# EasyEDA Pro project ProPrj_IoT Animal Trap_2026-03-28 1.epro, board PCB1
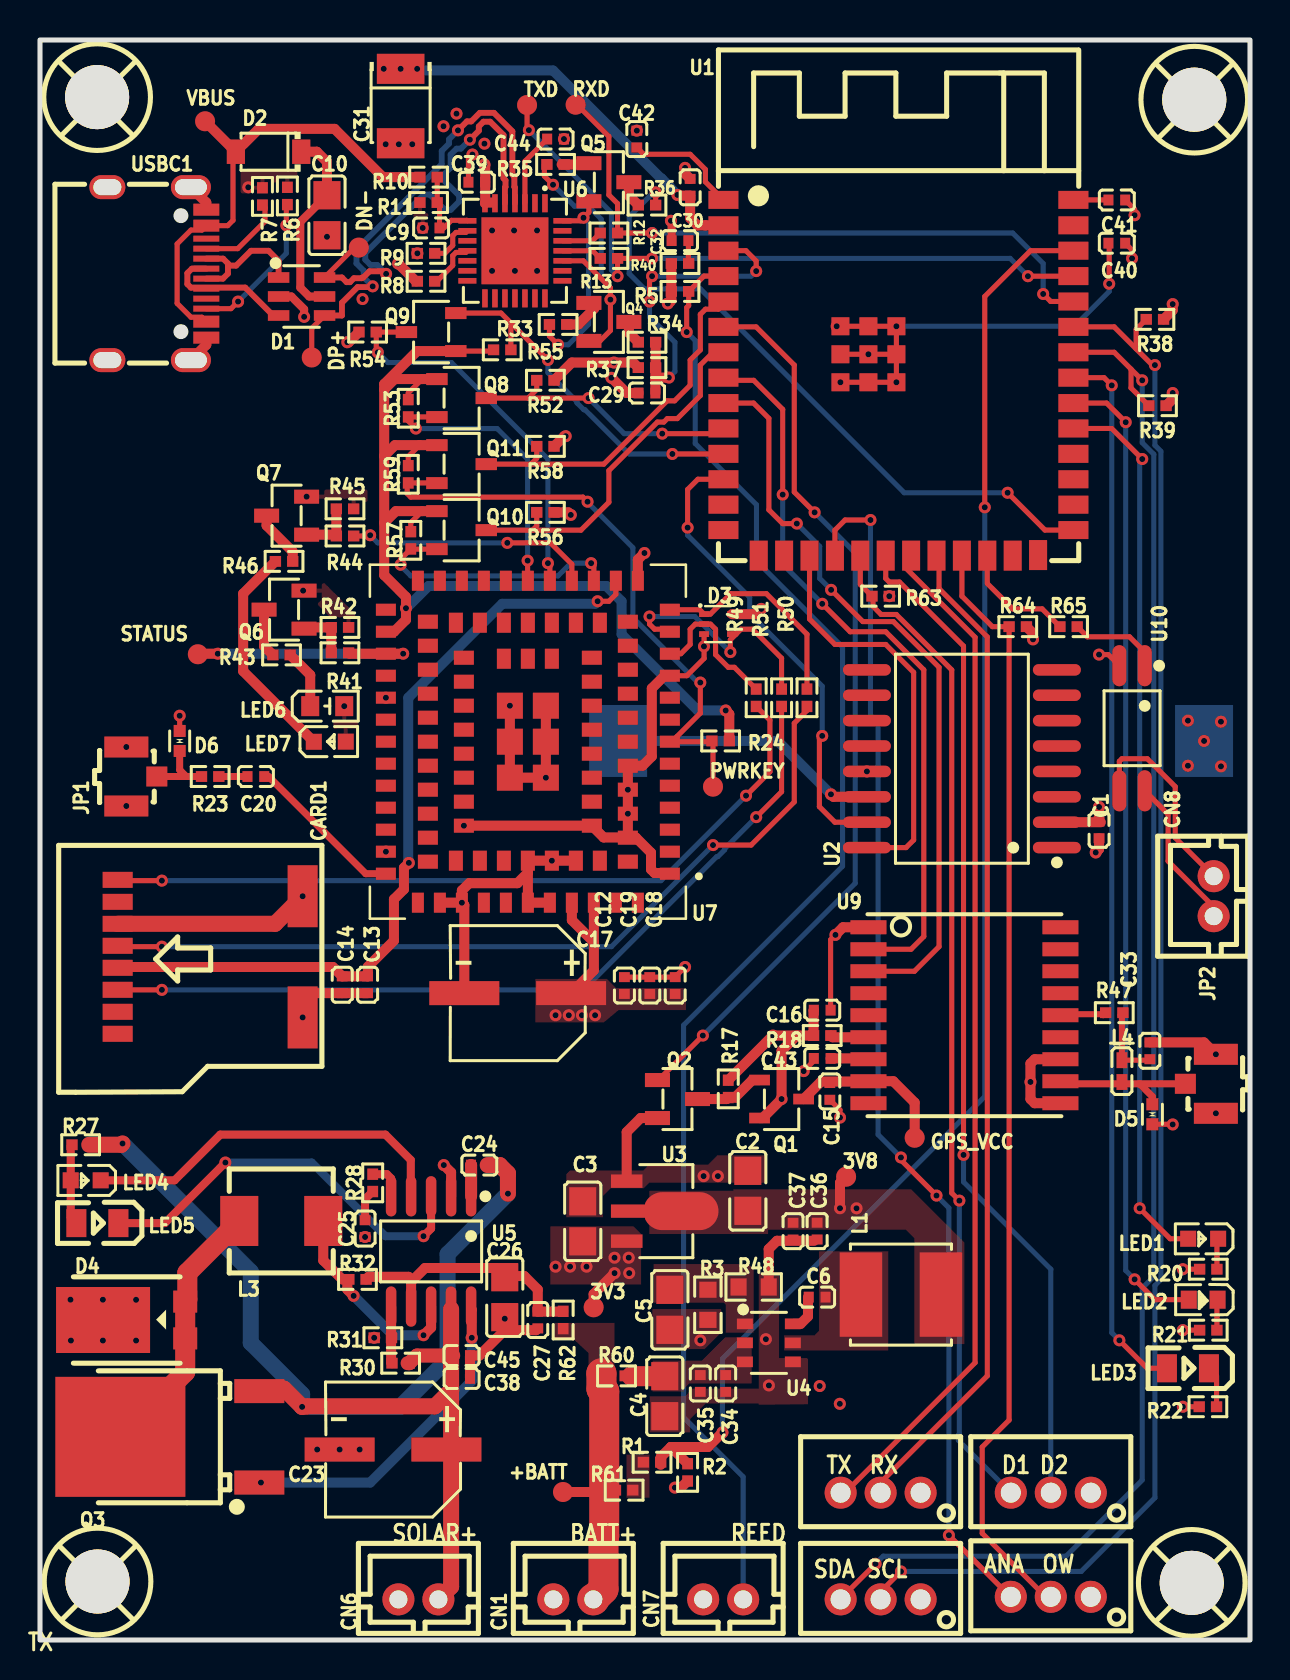
[diagram p1: board, top side]
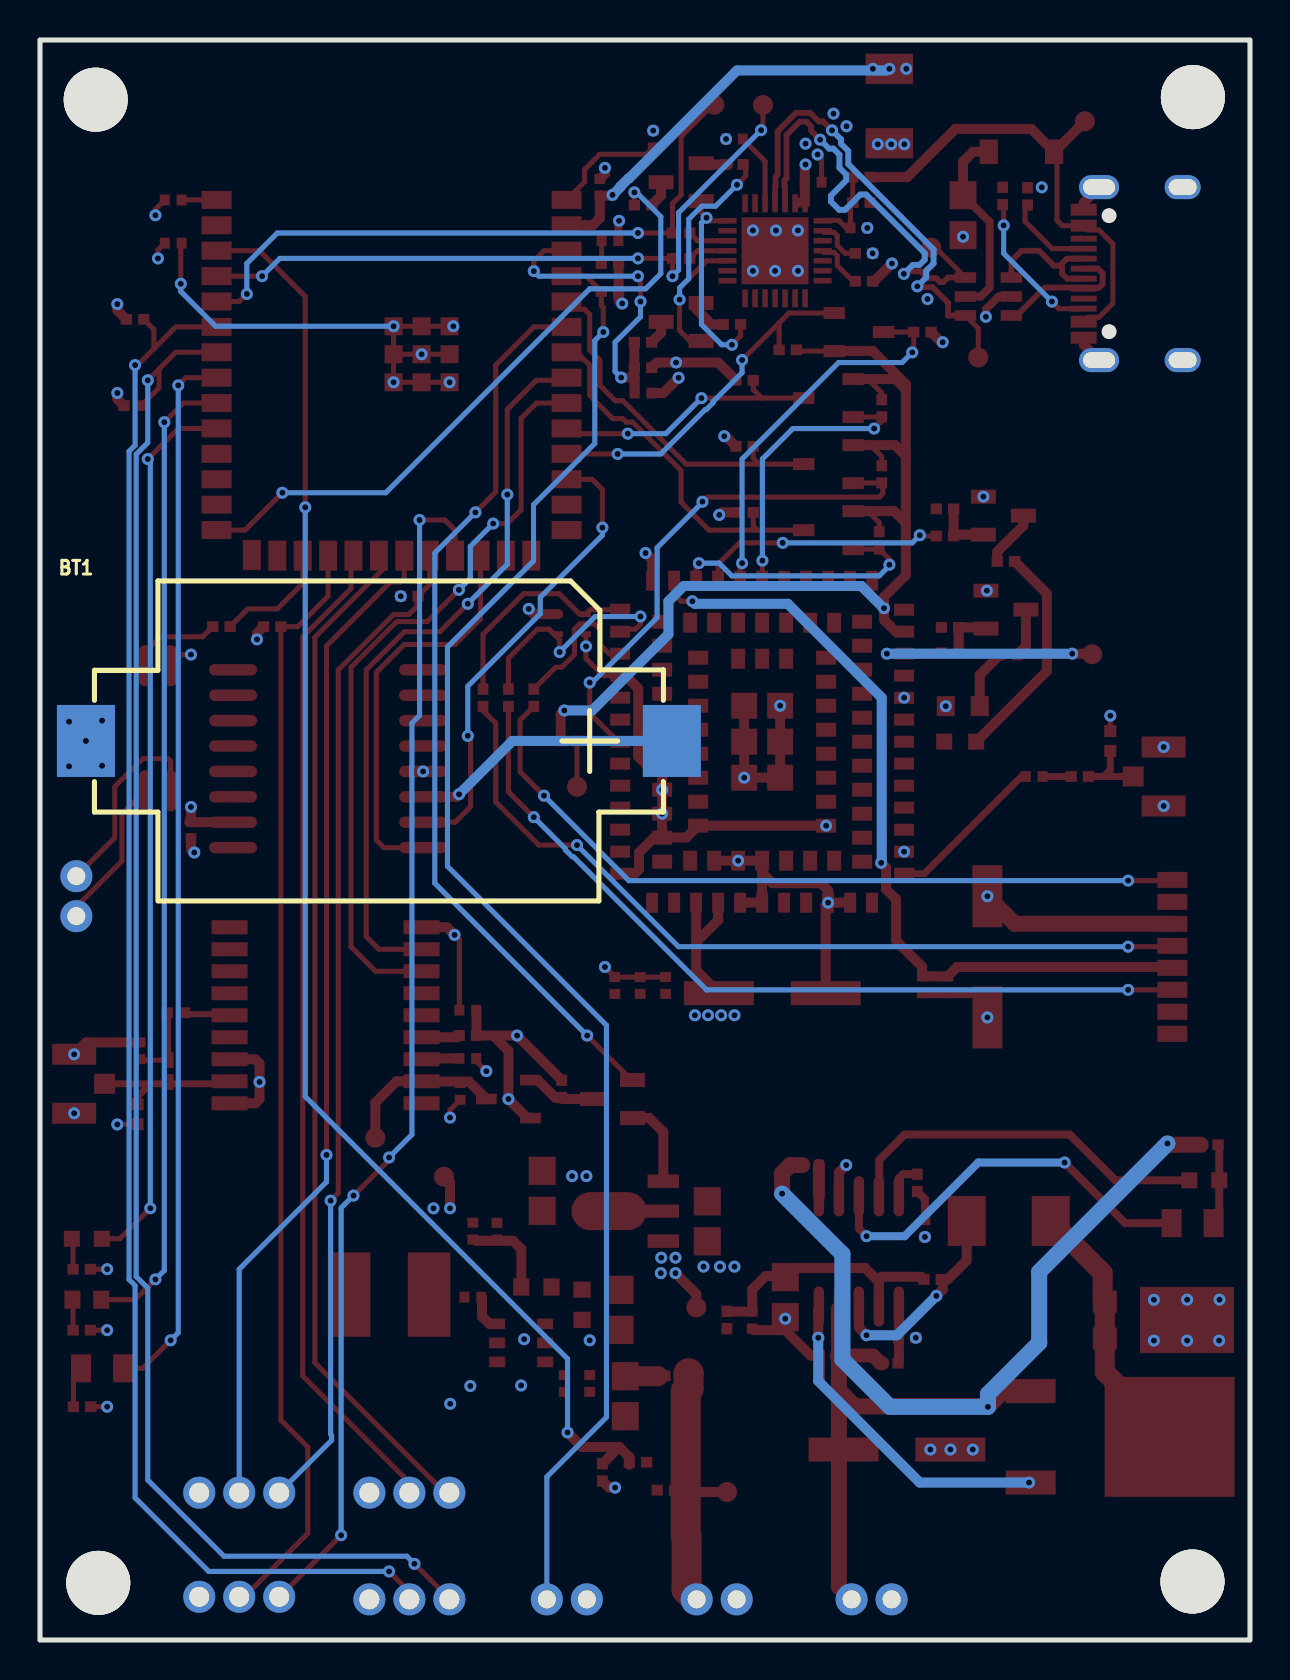
[diagram p2: board, bottom side, seen from below]

Outline 60.51 x 80.01 mm; copper layers: Top Layer, Ground Ref, Power Plane, Inner3, Inner4, Inner5, Inner6, Inner7, Inner8, Inner9, Inner10, Inner11, Inner12, Inner13, Inner14, Inner15, Inner16, Inner17, Inner18, Inner19, Inner20, Inner21, Inner22, Inner23, Inner24, Inner25, Inner26, Inner27, Inner28, Inner29, Inner30, Bottom Layer. Coordinates in mm from the lower left corner of the outline.
Outline path: rectangle 0,80.01 60.51,0
Stack: Top Layer 0.035mm Outer layer thickness 1oz / Dielectric1 0.2104mm 7628 RC49% 8.6mil / Ground Ref 0.0152mm Inner layer thickness / Dielectric2 1.065mm 1.1mm H/HOZ Copper / Power Plane 0.0152mm Inner layer thickness / Dielectric3 0.2104mm 7628 RC49% 8.6mil / Bottom Layer 0.035mm Outer layer thickness 1oz

## Design rules (mm)
net $1N3598: DP1
net $1N3569: DP1
net DP+: DP2
net DN-: DP2
template: Custom Config
spacing copperThickness1oz (default): track to track 0.102, other pairs 0.152 to 0.3
spacing copperThickness2oz: track to track 0.203, other pairs 0.152 to 0.3
track width copperThickness1oz (default): min 0.2, default 0.254, max 2.54
track width copperThickness2oz: min 0.203, default 0.254, max 2.54
track width 3V3: min 0.5, default 0.5, max 2.54
differential pair differentialPair (default): width min 0.127, default 0.254, max 2.54; gap min 0.152, default 0.152
via viaSize (default): diameter min 0.5, default 0.6, max 10; hole min 0.3, default 0.305, max 6.3
net 3V3 uses 3V3

## Placement (name value [footprint] x y rotation side)
3V3  -  [Test-Point-0.5mm]  27.69 16.64 0 top
3V8  -  [Test-Point-0.5mm]  40.31 23.17 0 top
+BATT  -  [Test-Point-0.5mm]  26.15 7.4 90 top
BT1  CR2032-B1  [BAT-SMD_CR2032-B1]  43.56 44.96 180 bottom
C1  100nF  [C0402]  52.96 40.51 90 top
C2  10uF  [C0805]  35.39 22.46 270 top
C3  10uF  [C0805]  27.14 20.94 270 top
C4  10uF  [C0805]  31.24 12.19 90 top
C5  47uF  [C0805]  31.5 16.51 270 top
C6  100nF  [C0402]  38.86 17.15 180 top
C9  100nF  [C0402]  19.56 70.61 0 top
C10  10uF  [C0805]  14.35 71.25 90 top
C12  100nF  [C0402]  29.22 32.73 270 top
C13  100nF  [C0402]  16.38 32.77 90 top
C14  22pF  [C0402]  15.11 32.77 90 top
C15  100nF  [C0402]  39.5 27.43 90 top
C16  100nF  [C0402]  39.12 31.5 180 top
C17  100uF  [CAP-SMD_BD6.3-L6.6-W6.6-LS7.2-FD]  23.89 32.35 180 top
C18  10pF  [C0402]  31.76 32.73 270 top
C19  33pF  [C0402]  30.49 32.73 270 top
C20  100pF  [C0402]  10.79 43.18 180 top
C23  47uF  [CAP-SMD_BD6.3-L6.6-W6.6-FD]  17.65 9.53 180 top
C24  100nF  [C0402]  21.97 23.75 0 top
C25  220nF  [C0402]  16.26 20.57 90 top
C26  47uF  [C0805]  23.24 17.15 90 top
C27  1uF  [C0402]  24.89 16 90 top
C29  100nF  [C0402]  30.35 62.36 0 top
C30  100nF  [C0402]  32.51 72.64 270 top
C31  10uF  [CASE-B_3528]  18.03 76.71 270 top
C32  100nF  [C0402]  32 69.98 0 top
C33  10nF  [C0402]  55.5 29.46 270 top
C34  100nF  [C0402]  34.29 12.83 90 top
C35  1uF  [C0402]  33.02 12.83 90 top
C36  22uF  [C0402]  38.86 20.45 90 top
C37  22uF  [C0402]  37.66 20.44 90 top
C38  1uF  [C0402]  21.08 13.08 180 top
C39  100nF  [C0402]  21.84 72.9 0 top
C40  100nF  [C0402]  53.85 69.85 180 top
C41  100nF  [C0402]  53.85 72.01 180 top
C42  100nF  [C0402]  29.84 75.06 90 top
C43  100nF  [C0402]  39.12 29.08 0 top
C44  100nF  [C0402]  25.78 75.06 180 top
C45  100nF  [C0402]  21.08 14.22 180 top
CARD1  TF-104  [TF-SMD_TF-104]  8.51 34.16 270 top
CN1  B2B-PH-K-S(LF)(SN)  [CONN-TH_B2B-PH-K-S]  26.67 2.03 0 top
CN2  B3B-PH-K-S(LF)(SN)  [CONN-TH_B3B-PH-K-S]  42.04 2.03 0 top
CN3  B3B-PH-K-S(LF)(SN)  [CONN-TH_B3B-PH-K-S]  50.55 7.37 0 top
CN4  B3B-PH-K-S(LF)(SN)  [CONN-TH_B3B-PH-K-S]  50.55 2.16 0 top
CN5  B3B-PH-K-S(LF)(SN)  [CONN-TH_B3B-PH-K-S]  42.04 7.37 0 top
CN6  B2B-PH-K-S(LF)(SN)  [CONN-TH_B2B-PH-K-S]  18.92 2.03 0 top
CN7  B2B-PH-K-S(LF)(SN)  [CONN-TH_B2B-PH-K-S]  34.16 2.03 0 top
CN8  B2B-PH-K-S(LF)(SN)  [CONN-TH_B2B-PH-K-S]  58.69 37.19 90 top
D1  USBLC6-2SC6  [SOT-23-6_L2.9-W1.6-P0.95-LS2.8-BL]  13.08 67.18 270 top
D2  1N5819HW-7-F  [SOD-123_L2.7-W1.6-LS3.7-RD]  11.43 74.42 180 top
D3  TPD3E001DRLR  [SOT-553-5_L1.6-W1.2-P0.50-LS1.6-TL]  33.91 50.8 0 top
D4  SB1045L  [TO-277_3P-L5.4-W4.0-LS6.5-TR]  5.21 16 0 top
D5  ESD701DPYR  [X1SON-2_L1.0-W0.6-P0.65-BI]  55.63 26.29 90 top
D6  ESD701DPYR  [X1SON-2_L1.0-W0.6-P0.65-BI]  6.98 44.96 270 top
DN-  -  [Test-Point-0.5mm]  15.94 69.63 0 top
DP+  -  [Test-Point-0.5mm]  13.59 64.14 0 top
GPS_VCC  -  [Test-Point-0.5mm]  43.74 25.12 0 top
JP1  6GHz  [RF-SMD_FRF05002-JSS103M]  5.08 43.18 90 top
JP2  6GHz  [RF-SMD_FRF05002-JSS103M]  58.04 27.81 270 top
L1  4.7uH  [IND-SMD_L5.0-W5.0]  43.05 17.27 180 top
L3  10uH  [IND-SMD_L5.2-W5.2_MCW-0530]  12.06 20.96 0 top
L4  27nH  [L0402-RD]  54.1 28.45 270 top
LED1  19-217/GHC-YR1S2/3T  [LED0603-RD]  58.17 20.07 180 top
LED2  19-217/BHC-ZL1M2RY/3T  [LED0603-FD_BLUE]  58.17 17.02 180 top
LED3  17-21SURC/S530-A3/TR8  [LED0805-R-RD]  57.4 13.59 180 top
LED4  19-217/GHC-YR1S2/3T  [LED0603-RD]  2.29 22.99 180 top
LED5  17-21SURC/S530-A3/TR8  [LED0805-R-RD]  2.87 20.85 180 top
LED6  SML-D12P8WT86C  [LED0603-FD_GREEN]  14.36 46.7 180 top
LED7  YLED0603Y  [LED0603-RD-1]  14.49 44.92 0 top
M1  -  [Screw-Hole-M3]  2.94 2.86 0 top
M2  -  [Screw-Hole-M3]  57.66 2.79 0 top
M3  -  [Screw-Hole-M3]  57.78 76.96 0 top
M4  -  [Screw-Hole-M3]  2.92 77.09 0 top
PWRKEY  -  [Test-Point-0.5mm]  33.66 42.67 0 top
Q1  SI2301CDS-T1-GE3  [SOT-23-3_L3.0-W1.7-P0.95-LS2.9-BR]  37.08 27.05 180 top
Q2  BSS138  [SOT-23-3_L2.9-W1.3-P1.90-LS2.4-BR_1]  31.88 27.05 180 top
Q3  AOD4185  [TO-252-3_L6.6-W6.1-P4.57-LS9.9-BR-CW]  7.49 10.16 0 top
Q4  L8050QLT1G  [SOT-23-3_L2.9-W1.3-P1.90-LS2.4-BR]  28.45 65.91 180 top
Q5  L8050QLT1G  [SOT-23-3_L2.9-W1.3-P1.90-LS2.4-BR]  28.45 72.9 180 top
Q6  S8050  [SOT-23-3_L2.9-W1.3-P1.90-LS2.4-BR]  12.21 51.52 0 top
Q7  S8050  [SOT-23-3_L2.9-W1.3-P1.90-LS2.4-BR]  12.33 56.22 0 top
Q8  BSS138  [SOT-23-3_L2.9-W1.6-P1.90-LS2.8-BR]  21.08 62.1 180 top
Q9  BSS138  [SOT-23-3_L2.9-W1.6-P1.90-LS2.8-BR]  19.56 65.41 0 top
Q10  BSS138  [SOT-23-3_L2.9-W1.6-P1.90-LS2.8-BR]  21.08 55.5 180 top
Q11  BSS138  [SOT-23-3_L2.9-W1.6-P1.90-LS2.8-BR]  21.08 58.8 180 top
R1  1MΩ  [R0402]  30.61 8.89 0 top
R2  470kΩ  [R0402]  32.38 8.38 90 top
R3  100kΩ  [R0603]  33.4 16.76 270 top
R5  100kΩ  [R0402]  32 67.44 180 top
R6  5.1kΩ  [R0402]  12.37 72.21 90 top
R7  5.1kΩ  [R0402]  11.12 72.19 90 top
R8  10kΩ  [R0402]  19.3 67.94 0 top
R9  1kΩ  [R0402]  19.3 69.34 0 top
R10  22.1kΩ  [R0402]  19.43 73.15 0 top
R11  47.5kΩ  [R0402]  19.43 71.88 0 top
R12  0Ω  [R0402]  28.45 70.36 0 top
R13  0Ω  [R0402]  28.45 69.09 0 top
R17  10kΩ  [R0402]  34.42 27.56 90 top
R18  100Ω  [R0402]  39.12 30.23 0 top
R20  22Ω  [R0402]  58.42 18.54 180 top
R21  22Ω  [R0402]  58.42 15.49 180 top
R22  22Ω  [R0402]  58.4 11.66 180 top
R23  0Ω  [R0402]  8.51 43.18 0 top
R24  10kΩ  [R0402]  34.04 44.96 180 top
R27  1kΩ  [R0402]  2.03 24.77 0 top
R28  120Ω  [R0402]  16.64 22.86 90 top
R30  64.9kΩ  [R0402]  18.03 13.84 0 top
R31  10kΩ  [R0402]  17.15 15.11 180 top
R32  100mΩ  [R0402]  15.88 18.03 0 top
R33  10kΩ  [R0402]  25.91 65.79 0 top
R34  0Ω  [R0402]  30.35 64.9 0 top
R35  10kΩ  [R0402]  25.78 73.79 0 top
R36  0Ω  [R0402]  30.35 71.75 0 top
R37  10kΩ  [R0402]  30.35 63.63 180 top
R38  4.7kΩ  [R0402]  55.75 66.04 0 top
R39  4.7kΩ  [R0402]  55.88 61.72 0 top
R40  10kΩ  [R0402]  32 68.83 180 top
R41  4.7kΩ  [R0402]  15 49.37 180 top
R42  47kΩ  [R0402]  15 50.64 0 top
R43  2.2kΩ  [R0402]  12.08 49.26 0 top
R44  4.7kΩ  [R0402]  15.25 55.21 180 top
R45  47kΩ  [R0402]  15.25 56.56 0 top
R46  2.2kΩ  [R0402]  12.21 53.94 180 top
R47  10Ω  [R0402]  53.72 31.37 0 top
R48  27kΩ  [R0603]  35.69 17.65 180 top
R49  0Ω  [R0402]  35.81 47.12 270 top
R50  0Ω  [R0402]  38.35 47.12 270 top
R51  0Ω  [R0402]  37.08 47.12 270 top
R52  10kΩ  [R0402]  25.27 62.99 180 top
R53  10kΩ  [R0402]  18.41 61.59 270 top
R54  10kΩ  [R0402]  16.38 65.41 0 top
R55  10kΩ  [R0402]  23.11 64.52 0 top
R56  10kΩ  [R0402]  25.27 56.39 180 top
R57  10kΩ  [R0402]  18.54 54.99 270 top
R58  10kΩ  [R0402]  25.27 59.69 180 top
R59  10kΩ  [R0402]  18.41 58.29 270 top
R60  0Ω  [R0402]  28.83 13.21 180 top
R61  0Ω  [R0402]  29.21 7.49 180 top
R62  0Ω  [R0402]  26.16 16 90 top
R63  10kΩ  [R0402]  42.04 52.2 0 top
R64  4.7kΩ  [R0402]  48.9 50.67 0 top
R65  330Ω  [R0402]  51.44 50.67 0 top
RXD  -  [SMD-1_BD1.5]  26.78 76.77 0 top
STATUS  -  [Test-Point-0.5mm]  7.89 49.29 90 top
TXD  -  [SMD-1_BD1.5]  24.36 76.76 0 top
U1  2.4GHz  [WIRELM-SMD_ESP32-S3-WROOM-1]  42.93 63.12 0 top
U2  DS3231SN#T&R  [SOIC-16_L10.3-W7.5-P1.27-LS10.3-BL]  46.1 44.07 90 top
U3  HT7333-A  [SOT-89-3_L4.5-W2.5-P1.50-LS4.2-BR]  30.7 21.44 180 top
U4  AP63300WU-7  [TSOT-23-6_L2.9-W1.6-P0.95-LS2.8-BR]  36.45 14.86 180 top
U5  CN3767  [SSOP-10_L4.9-W3.9-P1.00-LS6.0-BL]  19.56 19.43 180 top
U6  CP2102N-A02-GQFN28R  [QFN-28_L5.0-W5.0-P0.50-TL-EP3.3]  23.75 69.47 270 top
U7  EG800Q-EU  [XCVR_EG800Q-EU]  24.4 44.92 180 top
U9  MAX-M10S-00B  [SMD-18_L10.1-W9.7-P1.10-TL_SKG09F]  46.23 31.24 0 top
U10  TLP291GB  [SO-4_L4.6-W2.6-P1.27-LS7.0]  54.61 45.59 270 top
USBC1  TYPE-C-31-M-12  [USB-C_SMD-TYPE-C-31-M-12_1]  5.84 68.33 270 top
VBUS  -  [Test-Point-0.5mm]  8.25 75.95 90 top

## Footprints (pads in the part's own frame, mm; a bottom-side part is the same pattern mirrored in y, then rotated)
BAT-SMD_CR2032-B1
  rect 2.9x3.6 smd: 1(14.65,0) 2(-14.65,0)
C0402
  rect 0.5x0.54 smd: 1(-0.42,0) 2(0.42,0)
C0805
  rect 1.41x1.35 smd: 1(-1,0) 2(1,0)
CAP-SMD_BD6.3-L6.6-W6.6-FD
  rect 3.5x1.2 smd: 1(-2.67,0) 2(2.67,0)
CAP-SMD_BD6.3-L6.6-W6.6-LS7.2-FD
  rect 3.5x1.2 smd: 1(-2.67,0) 2(2.67,0)
CASE-B_3528
  rect 1.506x2.376 smd: 1(-1.861,0) 2(1.861,0)
CONN-TH_B2B-PH-K-S
  round 1.6 hole 0.9: 1(1,0) 2(-1,0)
CONN-TH_B3B-PH-K-S
  round 1.6 hole 1: 1(2,0) 2(0,0) 3(-2,0)
IND-SMD_L5.0-W5.0
  rect 2.124x4.22 smd: 1(2,0) 2(-2,0)
IND-SMD_L5.2-W5.2_MCW-0530
  rect 1.9x2.5 smd: 1(-2.1,0) 2(2.1,0)
L0402-RD
  rect 0.79x0.54 smd: 1(-0.545,0) 2(0.545,0)
LED0603-FD_BLUE
  rect 0.8x0.9 smd: 1(-0.72,0) 2(0.72,0)
LED0603-FD_GREEN
  rect 0.9x1 smd: 1(-0.85,0) 2(0.85,0)
LED0603-RD
  rect 0.8x0.8 smd: 1(-0.749,0) 2(0.749,0)
LED0603-RD-1
  rect 0.8x0.8 smd: 1(-0.799,-0.004) 2(0.799,0.004)
LED0805-R-RD
  rect 1x1.399 smd: 1(1.05,0) 2(-1.05,0)
QFN-28_L5.0-W5.0-P0.50-TL-EP3.3
  rect 0.905x0.28 smd: 1(-2.377,1.5) 2(-2.377,1) 3(-2.377,0.5) 4(-2.377,0) 5(-2.377,-0.5) 6(-2.377,-1) 7(-2.377,-1.5) 15(2.377,-1.5) 16(2.377,-1) 17(2.377,-0.5) 18(2.377,0) 19(2.377,0.5) 20(2.377,1) 21(2.377,1.5)
  rect 0.28x0.905 smd: 8(-1.5,-2.377) 9(-1,-2.377) 10(-0.5,-2.377) 11(0,-2.377) 12(0.5,-2.377) 13(1,-2.377) 14(1.5,-2.377) 22(1.5,2.377) 23(1,2.377) 24(0.5,2.377) 25(0,2.377) 26(-0.5,2.377) 27(-1,2.377) 28(-1.5,2.377)
  rect 3.35x3.35 smd: 29(0,0)
R0402
  rect 0.566x0.54 smd: 1(-0.433,0) 2(0.433,0)
R0603
  rect 0.806x0.864 smd: 1(-0.753,0) 2(0.753,0)
RF-SMD_FRF05002-JSS103M
  rect 1x1.05 smd: 1(0,-0.762)
  rect 1.05x2.2 smd: 2(-1.475,0.762) 3(1.475,0.762)
Screw-Hole-M3
  round 3.2 hole 3.2: 1(-0.064,0.064)
SMD-1_BD1.5
  round 1 smd: 1(0,0)
SMD-18_L10.1-W9.7-P1.10-TL_SKG09F
  rect 1.8x0.7 smd: 1(-4.8,4.4) 2(-4.8,3.3) 3(-4.8,2.2) 4(-4.8,1.1) 5(-4.8,0) 6(-4.8,-1.1) 7(-4.8,-2.2) 8(-4.8,-3.3) 9(-4.8,-4.4) 10(4.8,-4.4) 11(4.8,-3.3) 12(4.8,-2.2) 13(4.8,-1.1) 14(4.8,0) 15(4.8,1.1) 16(4.8,2.2) 17(4.8,3.3) 18(4.8,4.4)
SO-4_L4.6-W2.6-P1.27-LS7.0
  oval 2.056x0.7 smd: 1(-3.128,0.635) 2(-3.128,-0.635) 3(3.128,-0.635) 4(3.128,0.635)
SOD-123_L2.7-W1.6-LS3.7-RD
  rect 0.91x1.22 smd: 1(-1.635,0) 2(1.635,0)
SOIC-16_L10.3-W7.5-P1.27-LS10.3-BL
  oval 0.574x2.401 smd: 1(-4.445,-4.75) 2(-3.175,-4.75) 3(-1.905,-4.75) 4(-0.635,-4.75) 5(0.635,-4.75) 6(1.905,-4.75) 7(3.175,-4.75) 8(4.445,-4.75) 9(4.445,4.75) 10(3.175,4.75) 11(1.905,4.75) 12(0.635,4.75) 13(-0.635,4.75) 14(-1.905,4.75) 15(-3.175,4.75) 16(-4.445,4.75)
SOT-23-3_L2.9-W1.3-P1.90-LS2.4-BR
  rect 1.25x0.7 smd: 1(1,-0.95) 2(1,0.95) 3(-1,0)
SOT-23-3_L2.9-W1.3-P1.90-LS2.4-BR_1
  rect 1.25x0.7 smd: 1(1,-0.95) 2(1,0.95) 3(-1,0)
SOT-23-3_L2.9-W1.6-P1.90-LS2.8-BR
  rect 1.07x0.6 smd: 1(1.235,-0.95) 2(1.235,0.95) 3(-1.235,0)
SOT-23-3_L3.0-W1.7-P0.95-LS2.9-BR
  rect 1.038x0.532 smd: 1(1.101,-0.95) 2(1.101,0.95) 3(-1.101,0)
SOT-23-6_L2.9-W1.6-P0.95-LS2.8-BL
  rect 0.532x1.072 smd: 1(-0.95,-1.149) 2(0,-1.149) 3(0.95,-1.149) 4(0.95,1.149) 5(0,1.149) 6(-0.95,1.149)
SOT-89-3_L4.5-W2.5-P1.50-LS4.2-BR
  rect 1.575x0.672 smd: 1(1.356,-1.5) 3(1.356,1.5)
  custom 5.377x1.9 smd: 2(-1.356,0)
SOT-553-5_L1.6-W1.2-P0.50-LS1.6-TL
  rect 0.5x0.29 smd: 1(-0.7,0.5) 2(-0.7,0) 3(-0.7,-0.5) 4(0.7,-0.5) 5(0.7,0.5)
SSOP-10_L4.9-W3.9-P1.00-LS6.0-BL
  oval 0.525x2.014 smd: 1(-2,-2.756) 2(-1,-2.756) 3(0,-2.756) 4(1,-2.756) 5(2,-2.756) 6(2,2.756) 7(1,2.756) 8(0,2.756) 9(-1,2.756) 10(-2,2.756)
Test-Point-0.5mm
  round 1 smd: 1(0,0)
TF-SMD_TF-104
  rect 0.8x1.5 smd: 1(3.85,-4.625) 2(2.75,-4.625) 3(1.65,-4.625) 4(0.55,-4.625) 5(-0.55,-4.625) 6(-1.65,-4.625) 7(-2.75,-4.625) 8(-3.85,-4.625)
  rect 3.1x1.5 smd: 9(-3.03,4.625) 10(3.03,4.625)
TO-252-3_L6.6-W6.1-P4.57-LS9.9-BR-CW
  rect 2.5x1.2 smd: 1(3.475,-2.286) 3(3.475,2.286)
  rect 6.5x6 smd: 2(-3.475,0)
TO-277_3P-L5.4-W4.0-LS6.5-TR
  rect 1.2x1.1 smd: 1(2.054,0.92) 3(2.054,-0.92)
  rect 4.7x3.3 smd: 2(-2.054,0)
TSOT-23-6_L2.9-W1.6-P0.95-LS2.8-BR
  rect 0.8x0.532 smd: 1(1.2,-0.95) 2(1.2,0) 3(1.2,0.95) 4(-1.2,0.95) 5(-1.2,0) 6(-1.2,-0.95)
USB-C_SMD-TYPE-C-31-M-12_1
  oval 1.2x2 hole 0.8x1.6: 1(4.325,1.706) 4(-4.325,1.706)
  oval 1.2x1.8 hole 0.8x1.4: 2(4.325,-2.474) 3(-4.325,-2.474)
  custom 0.6x1.3 smd: A1B12(-3.2,2.474) A4B9(-2.4,2.474) B1A12(3.2,2.474) B4A9(2.401,2.474)
  rect 0.3x1.3 smd: A5(-1.25,2.474) A6(-0.25,2.474) A7(0.25,2.474) A8(1.25,2.474) B5(1.75,2.474) B6(0.75,2.474) B7(-0.75,2.474) B8(-1.75,2.474)
WIRELM-SMD_ESP32-S3-WROOM-1
  rect 1.5x0.9 smd: 1(-8.75,8.895) 2(-8.75,7.625) 3(-8.75,6.355) 4(-8.75,5.085) 5(-8.75,3.815) 6(-8.75,2.545) 7(-8.75,1.275) 8(-8.75,0.005) 9(-8.75,-1.265) 10(-8.75,-2.535) 11(-8.75,-3.805) 12(-8.75,-5.075) 13(-8.75,-6.345) 14(-8.75,-7.615) 27(8.75,-7.615) 28(8.75,-6.345) 29(8.75,-5.075) 30(8.75,-3.805) 31(8.75,-2.535) 32(8.75,-1.265) 33(8.75,0.005) 34(8.75,1.275) 35(8.75,2.545) 36(8.75,3.815) 37(8.75,5.085) 38(8.75,6.355) 39(8.75,7.625) 40(8.75,8.895)
  rect 0.9x1.5 smd: 15(-6.985,-8.895) 16(-5.715,-8.895) 17(-4.445,-8.895) 18(-3.175,-8.895) 19(-1.905,-8.895) 20(-0.635,-8.895) 21(0.635,-8.895) 22(1.905,-8.895) 23(3.175,-8.895) 24(4.445,-8.895) 25(5.715,-8.895) 26(6.985,-8.865)
  rect 0.9x0.9 smd: 41(-2.9,2.575) 41(-2.9,1.175) 41(-2.9,-0.225) 41(-1.5,2.575) 41(-1.5,1.175) 41(-1.5,-0.225) 41(-0.1,2.575) 41(-0.1,1.175) 41(-0.1,-0.225)
X1SON-2_L1.0-W0.6-P0.65-BI
  rect 0.6x0.6 smd: 1(-0.5,0) 2(0.5,0)
XCVR_EG800Q-EU
  rect 1x0.6 smd: 1(-7.1,6.6) 2(-7.1,5.5) 3(-7.1,4.4) 4(-7.1,3.3) 5(-7.1,2.2) 6(-7.1,1.1) 7(-7.1,0) 8(-7.1,-1.1) 9(-7.1,-2.2) 10(-7.1,-3.3) 11(-7.1,-4.4) 12(-7.1,-5.5) 13(-7.1,-6.6) 23(7.1,-6.6) 24(7.1,-5.5) 25(7.1,-4.4) 26(7.1,-3.3) 27(7.1,-2.2) 28(7.1,-1.1) 29(7.1,0) 30(7.1,1.1) 31(7.1,2.2) 32(7.1,3.3) 33(7.1,4.4) 34(7.1,5.5) 35(7.1,6.6)
  rect 0.6x1 smd: 14(-4.4,-8.05) 15(-3.3,-8.05) 16(-2.2,-8.05) 17(-1.1,-8.05) 18(0,-8.05) 19(1.1,-8.05) 20(2.2,-8.05) 21(3.3,-8.05) 22(4.4,-8.05) 36(4.4,8.05) 37(3.3,8.05) 38(2.2,8.05) 39(1.1,8.05) 40(0,8.05) 41(-1.1,8.05) 42(-2.2,8.05) 43(-3.3,8.05) 44(-4.4,8.05) 95(-5.5,-8.05) 96(5.5,-8.05) 97(5.5,8.05) 98(-5.5,8.05)
  rect 1x0.7 smd: 45(-5,4.8) 46(-5,3.6) 47(-5,2.4) 48(-5,1.2) 49(-5,0) 50(-5,-1.2) 51(-5,-2.4) 52(-5,-3.6) 53(-5,-4.8) 59(5,-4.8) 60(5,-3.6) 61(5,-2.4) 62(5,-1.2) 63(5,0) 64(5,1.2) 65(5,2.4) 66(5,3.6) 67(5,4.8) 73(-3.2,4.2) 74(-3.2,3) 75(-3.2,1.8) 76(-3.2,0.6) 77(-3.2,-0.6) 78(-3.2,-1.8) 79(-3.2,-3) 80(-3.2,-4.2) 81(3.2,-4.2) 82(3.2,-3) 83(3.2,-1.8) 84(3.2,-0.6) 85(3.2,0.6) 86(3.2,1.8) 87(3.2,3) 88(3.2,4.2) 99(-5,6) 100(-5,-6) 103(5,-6) 104(5,6)
  rect 0.7x1 smd: 54(-2.4,-5.95) 55(-1.2,-5.95) 56(0,-5.95) 57(1.2,-5.95) 58(2.4,-5.95) 68(2.4,5.95) 69(1.2,5.95) 70(0,5.95) 71(-1.2,5.95) 72(-2.4,5.95) 101(-3.6,-5.95) 102(3.6,-5.95) 105(3.6,5.95) 106(-3.6,5.95) 107(-1.2,-4.15) 108(0,-4.15) 109(1.2,-4.15)
  rect 1.3x1.3 smd: 89(-0.9,1.8) 90(0.9,1.8) 91(-0.9,0) 92(0.9,0) 93(-0.9,-1.8) 94(0.9,-1.8)

## Nets
As in the schematic.

Pads without a net: CARD1 1 2 7; U1 13 14 15 16 25 26 28 39; U2 1 3 4 5 6 7 8 9 10 11 12; U6 1 2 10 12 13 14 15 16 17 18 19 20 21 22 23 27; U7 2 3 4 5 6 8 9 19 20 21 22 23 26 28 29 30 31 32 33 38 39 44 49 50 51 52 53 54 55 56 57 58 59 60 61 62 63 64 65 66 67 68 69 74 75 76 77 78 80 81 82 83 84 85 86 87 96 97 98 99 100 101 102 103 104 105 106 107 108 109; U9 4 5 9 13 15 16 17 18; USBC1 A8 B8

## Via types
v1: diameter 0.6, hole 0.305, Top Layer to Bottom Layer, 209 vias
v2: diameter 0.61, hole 0.305, Top Layer to Bottom Layer, 1 via

## Routing (per net, layer and track width the routed paths; a pad name or vN(x,y) marks a point on that pad's centre or on a via; arc(x,y) is an arc through that point)
3V3: length 52.1
  Top Layer w0.5: v1(56.64,66.8) 56.64,66.5 R38.2 ; 22.26,71.86 22.28,71.88 22.61,71.88 ; 22.26,71.86 C39.2 22.26,73.75 v1(22.22,73.79) ; 22.26,71.86 U6.7 ; R52.1 26.59,63.88 v1(28.7,63.88) 29.67,63.88 R37.2 ; R58.1 26.21,60.2 v1(26.29,60.2) ; D3.5 35.81,51.3 v1(36.07,51.56) ; v1(15.37,64.9) 15.44,64.9 R54.1 ; R64.2 49.66,50.34 v1(49.66,50.04) ; R40.2 R5.2 31.57,67.01 31.5,66.93 ; U2.2 53.05,40.89 ; 3V3.1 27.69,17.3 v1(28.73,18.35) ; 31.5,66.93 v1(31.4,66.83) ; 31.5,66.93 31.54,66.93 ; U1.2 33.28,70.74 33.27,70.74 32.88,70.74 32.51,71.11 C30.2 31.92,72.22 v1(31.88,72.26) ; C16.2 38.68,31.48 R18.1 37.85,30.23 ; Q1.2 36.13,26.1 v1(37.08,27.05) 37.08,29.46 37.85,30.23 ; 37.85,30.23 v1(36.65,30.23) R17.2 ; R39.2 56.64,62.05 v1(56.64,62.36) ; v1(26.54,56.26) 26.42,56.39 R56.1 ; C1.2 v1(52.96,41.66)
  Bottom Layer w0.5: v1(31.88,72.26) 31.49,72.65 31.49,72.68 31.08,73.09 31.05,73.09 25.65,78.49 18.16,78.49
  vias: v1(15.21,46.7) v1(17.19,78.57) v1(18.03,78.57) v1(18.86,78.57) v1(18.87,69.34) v1(25.78,18.67) v1(26.51,18.67) v1(27.33,18.67) v1(28.73,19.12) v1(29.44,19.12) v1(29.46,18.35) v1(42.47,52.2)
3V8: length 9.1
  Top Layer w0.5: U7.42 26.6,36 27.7,34.9 ; 27.7,34.9 27.7,33.49 C17.1 ; 27.7,34.9 U7.43 ; 3V8.1 40,22.86 v1(40,21.59)
  vias: v1(25.78,31.24) v1(26.44,31.24) v1(27.1,31.24) v1(27.76,31.24) v1(33.02,14.99) v1(40.83,21.59)
+5V: length 9.7
  Top Layer w0.4: C10.2 13.02,70.91 13.02,67.63 13.46,67.18 D1.5
  Top Layer w0.5: C10.2 14.35,73.91 13.84,74.42 D2.1
GND: length 119.3
  Top Layer w0.254: 23.24,15.69 23.42,15.51 ; R22.2 v1(57.15,11.66) ; C40.1 54.61,69.51 v1(54.61,69.09) ; C39.1 21.42,74.08 v1(21.62,74.28) ; v1(38.19,28.45) 38.7,28.96 C43.1 ; 54.74,71.37 54.74,71.54 C41.1 ; v1(52.96,49.28) 53.42,49.28 U10.2 ; C15.1 40,26.5 v1(40,26.12) ; U7.10 32.35,48.22 33.21,49.08 D3.3 ; R20.2 v1(57.15,18.54) ; C16.1 39.54,35.02 v1(39.78,35.26) ; D6.1 v1(6.98,46.22) ; R21.2 v1(57.15,15.49) ; v1(56.64,25.78) 56.63,25.79 D5.1 ; v1(32.26,33.66) 31.75,33.15 C19.1 C12.1
  Top Layer w0.4: D1.2 12.57,67.18 13.21,66.55 v1(13.21,66.17) ; v1(31.55,70.97) 31.58,70.94 C32.1
  Top Layer w0.5: v1(31.75,7.62) 32.06,7.62 R2.1 ; 31.23,48.22 30.59,47.59 30.59,44.18 30.13,43.72 U7.48 v1(29.4,42.52) v1(29.4,41.32) U7.45 ; C26.1 v1(23.24,16.07) 23.24,15.49 21.97,14.22 C45.1 C38.1 ; C17.2 21.22,36.75 v1(21.1,36.87) ; v1(58.8,29.29) 58.21,29.88 C33.1 ; U7.1 31.46,38.35 30.73,38.35 30.55,38.53 30.55,39.37 29.8,40.12 U7.45 ; U5.2 20.56,23.38 v1(20.19,23.75) ; v1(30.23,54.36) 29.9,54.03 U7.95 ; U7.72 v1(25.6,38.97) 24.7,38.97 ; USBC1.B1A12 8.32,64.77 USBC1.1 ; U7.41 U7.40 24.4,38.37 ; U7.45 29.39,40.13 28.19,40.13 U7.73 v1(21.2,40.72) ; U3.1 29.34,25.4 30.04,26.1 Q2.2 ; 24.4,38.37 23.88,37.85 21.46,37.85 21.1,37.48 v1(21.1,36.87) ; 24.4,38.37 U7.70 ; C13.1 C14.1 13.68,32.35 13.13,31.8 ; U9.1 40.16,35.64 v1(39.78,35.26) ; v1(23.5,46.72) U7.92 U7.90 v1(25.3,43.12) U7.91 U7.93 ; 23.42,15.51 23.43,15.49 24.8,15.49 24.82,15.51 ; v1(28.57,63.12) 29.34,62.36 29.93,62.36 ; U9.10 49.74,26.84 49.53,27.05 v1(49.53,27.91) 49.53,28.83 49.74,29.04 U9.12 ; v1(17.91,68.83) 18.8,67.94 R8.1 ; v1(52.79,39.38) 52.96,39.55 C1.1 ; 38.71,19.96 36.85,19.96 36.44,19.55 R48.1 ; v1(21.1,36.87) U7.36 ; USBC1.4 8.32,71.88 USBC1.A1B12 ; v1(32.26,73.62) 32.26,73.32 C30.1
  Top Layer w0.8: CARD1.6 11.75,35.81 v1(13.13,37.19) ; 13.13,31.8 v1(13.13,31.13)
  vias: v1(1.52,17.02) v1(1.55,14.97) v1(3.14,17.02) v1(3.14,14.97) v1(4.32,44.66) v1(4.32,41.7) v1(4.81,17.01) v1(4.81,14.97) v1(10.41,72.64) v1(13.16,52.47) v1(13.33,57.17) v1(13.86,9.52) v1(14.35,70.17) v1(14.98,9.53) v1(15.99,9.52) v1(16.13,67.06) v1(16.26,20.15) v1(16.71,15.11) v1(17.29,74.8) v1(17.3,47.12) v1(17.3,39.42) v1(17.94,74.8) v1(18.62,74.8) v1(19.14,70.61) v1(20.18,75.7) v1(20.83,76.33) v1(22.22,74.83) v1(22.61,70.48) v1(22.61,68.46) v1(23.71,70.48) v1(23.75,68.46) v1(24.86,70.48) v1(24.86,68.46) v1(26.2,75.06) v1(29.84,75.48) v1(33.2,49.69) v1(33.19,23.2) v1(33.9,23.2) v1(36.3,15.04) v1(36.45,12.73) v1(38.99,12.7) v1(40,11.81) v1(41.35,43.43) v1(54.74,71.25) v1(57.4,45.97) v1(57.4,43.72) v1(58.21,44.96) v1(58.8,26.34) v1(59.06,45.92) v1(59.06,43.69)
VBUS: length 24.4
  Top Layer w0.254: 9.79,74.42 9.65,74.28 9.65,70.99 9.38,70.73 USBC1.A4B9 8.09,70.5 7.55,70.5 6.86,69.81 6.86,66.84 7.55,66.15 8.09,66.15 USBC1.B4A9
  Top Layer w0.5: R10.1 17.15,73.15 14.73,75.56 10.94,75.56 9.79,74.42 9.78,74.42 VBUS.1
VDD_EXT: length 53.7
  Top Layer w0.254: 18.98,59.75 18.41,59.18 R59.1 ; 19.11,56.45 18.54,55.88 R57.1 ; Q9.1 22.62,64.45 R55.1 ; R53.1 18.41,62.36 19.11,63.05
  Top Layer w0.5: Q9.1 18.86,64.45 17.21,62.81 17.21,62.53 ; R24.1 34.47,46.3 v1(34.29,46.48) ; 17.21,62.53 17.73,63.05 19.85,63.05 ; 17.21,62.53 17.21,59.21 ; U7.24 17.71,50.42 18.3,51.02 v1(18.3,51.6) 18.3,52.16 17.21,53.25 17.21,55.86 ; 19.85,59.75 17.75,59.75 17.21,59.21 ; 17.21,55.86 17.8,56.45 19.85,56.45 ; 17.21,55.86 17.21,59.21
  Bottom Layer w0.5: 18.29,51.56 19.43,52.7 28.32,52.7 29.08,51.94 29.08,50.29 32.89,46.48 v1(34.29,46.48)
+BATT: length 13.7
  Top Layer w0.5: 28.22,7.32 28.14,7.4 +BATT.1
  Top Layer w1.5: CN1.1 28.18,2.54 28.18,5.17 28.22,5.2 28.22,12.43 28.08,12.56 28.08,13.32 28.07,13.34
BATT_SENSE: length 72.8
  Top Layer w0.254: U1.38 49.53,69.47 47.24,67.18 v1(47.24,56.64)
  Top Layer w0.5: R2.2 31.55,9.65 ; 31.55,9.65 33.4,9.65 v1(34.13,10.38) ; 31.55,9.65 31.04,9.14 31.04,8.76
  Bottom Layer w0.254: v1(47.24,56.64) 47.24,27.18 34.13,14.06 v1(34.13,10.38)
CHIP_PU: length 16.7
  Top Layer w0.254: U1.3 35.3,69.47 35.81,68.96 v1(35.81,68.45) ; v1(30.61,68.2) 30.48,68.07 v1(30.48,66.93)
  Top Layer w0.5: 30.77,63.08 30.82,63.13 v1(31.45,63.13) ; 30.77,63.08 C29.2 ; 30.77,63.08 30.77,63.61 R37.1 R34.2
  Bottom Layer w0.254: v1(30.48,66.93) 30.48,66.17 31.75,64.9 31.75,63.43 v1(31.45,63.13) ; v1(30.61,68.2) 35.56,68.2 v1(35.81,68.45)
DN-: length 23.8
  Top Layer w0.254: DN-.1 15.73,69.63 14.23,68.13
  Top Layer w0.291: v1(17.31,68.31) 17.18,68.44 16.48,68.44 16.17,68.13 16.12,68.13 16.08,68.1 15.7,68.1 15.5,67.9 15.33,67.9 15.1,68.13 14.23,68.13 ; U6.5 23.25,72.63 23.28,72.66 23.28,72.99 23.18,73.09 23.18,75.26 22.51,75.92 22.18,75.92 21.94,75.69 21.94,75.47 v1(21.5,75.02)
  Bottom Layer w0.291: v1(21.5,75.02) 21.05,74.58 20.83,74.58 20.53,74.28 20.53,73.62 20.19,73.28 20.19,72.99 20.96,72.22 20.96,71.93 20.54,71.52 20.25,71.52 19.49,72.28 19.2,72.28 16.27,69.35 16.27,69.02 16.53,68.76 16.86,68.76 v1(17.31,68.31)
DP+: length 23.2
  Top Layer w0.254: D1.4 13.59,65.59 13.59,64.26 13.72,64.14
  Top Layer w0.291: v1(16.64,67.69) 16.6,67.65 15.88,67.65 15.1,66.87 15.1,66.23 D1.4 ; U6.4 23.75,72.63 23.72,72.66 23.72,73.18 23.62,73.28 23.62,75.44 22.7,76.37 22,76.37 21.57,75.94 21.35,75.94 v1(20.9,75.49)
  Bottom Layer w0.291: v1(16.64,67.69) 16.19,68.14 16.19,68.47 15.82,68.84 15.82,69.54 20.09,73.8 20.09,74.46 20.45,74.83 20.45,75.04 v1(20.9,75.49)
DTR: length 10.6
  Top Layer w0.254: Q5.2 27.45,71.39 v1(27.18,71.12) 27.03,70.97 U6.28 ; R33.1 25.47,65.2 v1(25.91,64.77)
  Bottom Layer w0.254: v1(27.18,71.12) 27.43,70.87 27.43,65.79 26.42,64.77 v1(25.91,64.77)
EXP_ANALOG: length 60
  Top Layer w0.254: v1(45.45,5.24) 48.53,2.16 CN4.3 ; v1(44.83,22.22) 43.05,24 v1(43.05,24.13) ; 39.75,54.22 39.75,55.5 40.26,56.01 v1(41.53,56.01)
  Bottom Layer w0.254: v1(44.83,22.22) 45.45,21.61 v1(45.45,5.24) ; v1(41.53,56.01) 41.53,46.23 41.91,45.85 41.91,43.69 41.93,43.67 41.93,43.19 41.91,43.17 41.91,25.27 v1(43.05,24.13)
EXP_DIGITAL_1: length 50.5
  Top Layer w0.254: U1.19 41.02,52.78 R63.1 41.66,52.14 41.66,51.69 42.06,51.28 42.82,51.28 45.59,48.51 45.59,22.35 v1(45.97,21.97)
  Bottom Layer w0.254: v1(45.97,21.97) 45.97,10.29 45.93,10.24 45.93,9.99 CN3.3
EXP_DIGITAL_2: length 50.6
  Top Layer w0.254: v1(46.18,24.26) 46.18,49.7 42.98,52.91 42.47,52.91 42.29,53.09 U1.20
  Bottom Layer w0.254: CN3.2 50.55,18.54 46.18,22.91 v1(46.18,24.26)
EXP_I2C_SCL: length 79
  Top Layer w0.254: 54.81,64.57 55.63,63.75 ; 54.81,64.57 54.81,65.53 R38.1 ; 54.81,64.57 53.72,65.66 U1.35 ; v1(43.05,3.43) 42.04,2.41
  Bottom Layer w0.254: v1(43.05,3.43) 52.07,3.43 55.75,7.11 55.75,17.73 56.05,18.03 56.05,59.44 55.75,59.74 v1(55.75,63.75)
EXP_I2C_SDA: length 78.7
  Top Layer w0.254: 54.56,63.55 v1(55.12,62.99) ; 54.56,63.55 54.56,62.61 R39.1 ; 54.56,63.55 53.72,64.39 U1.34 ; v1(41.78,3.81) 40.39,2.41
  Bottom Layer w0.254: v1(41.78,3.81) 42.16,4.19 51.31,4.19 55.12,8 55.12,17.6 55.7,18.18 55.7,59.3 55.12,59.87 v1(55.12,62.99)
EXP_ONEWIRE: length 55.7
  Top Layer w0.254: U1.23 46.1,52.2 47.62,50.67 R64.1 48.46,11 47.12,9.65 47.12,5.33 50.29,2.16 CN4.2
EXP_UART_RX: length 50.5
  Top Layer w0.254: 42.04,6.99 42.04,7.87 47.37,13.21 47.37,50.16 44.96,52.57 44.96,54.1 U1.22
EXP_UART_TX: length 51.6
  Top Layer w0.254: U1.21 43.31,53.97 43.31,53.59 46.76,50.14 46.76,13.87 40.04,7.14 40.04,6.99
GPIO0: length 32.8
  Top Layer w0.254: v1(48.39,57.37) 50.25,55.5 U1.27 ; R36.2 v1(30.79,72.39)
  Bottom Layer w0.254: v1(30.79,72.39) 30.68,72.39 29.46,71.18 29.46,68.33 30.23,67.56 33.02,67.56 43.21,57.37 v1(48.39,57.37)
GPS_PWR: length 45.5
  Top Layer w0.254: v1(33.15,30.23) 30.92,28 Q2.1 ; v1(38.74,56.39) 37.72,57.4 37.72,63.75 35.81,65.66 U1.6
  Bottom Layer w0.254: v1(38.74,56.39) 40.77,54.36 40.77,37.85 v1(33.15,30.23)
GPS_RX: length 37.9
  Top Layer w0.254: v1(37.85,55.83) 37.14,55.83 36.45,56.52 36.45,61.09 35.68,61.85 U1.9 ; v1(39.56,52.51) 41.15,50.93 42.67,50.93 44.96,48.64 44.96,34.67 43.73,33.44 U9.3
  Bottom Layer w0.254: v1(37.85,55.83) 38.99,54.68 38.99,53.09 v1(39.56,52.51)
GPS_TX: length 37
  Top Layer w0.254: U9.2 43.56,34.54 44.2,35.18 44.2,48.51 42.29,50.42 40.51,50.42 v1(39.12,51.82) ; U1.8 34.31,62.99 35.69,62.99 37.14,61.54 v1(37.14,57.28)
  Bottom Layer w0.254: v1(39.12,51.82) 37.14,53.79 v1(37.14,57.28)
GPS_VCC: length 8.1
  Top Layer w0.5: Q1.3 39.06,27.93 41.41,27.93 ; U9.8 42.67,27.94 43.74,26.87 GPS_VCC.1
GREEN_LED: length 44.7
  Top Layer w0.254: U1.31 53.59,60.58 v1(55.12,59.06) ; LED1.2 56.51,20.07 v1(54.99,21.59)
  Bottom Layer w0.254: v1(55.12,59.06) 54.99,58.93 v1(54.99,21.59)
MODEM_PWRKEY: length 18.1
  Top Layer w0.254: 24.55,58.8 24.84,59.09 R58.2 ; 24.55,58.8 28.19,58.8 31.36,61.97 31.73,61.97 32.51,62.74 32.51,64 33.02,64.51 33.02,66.29 33.28,66.55 33.92,66.55 34.18,66.8 U1.5 ; 24.55,58.8 Q11.3
MODEM_RST: length 18.3
  Top Layer w0.254: 24.63,55.5 Q10.3 ; 24.63,55.5 27.05,55.5 28.45,56.9 28.45,58.48 30.88,60.9 31.2,60.9 31.37,61.08 31.87,61.08 33.02,62.23 33.02,63.75 33.66,64.39 U1.7 ; 24.63,55.5 24.84,55.71 R56.2
MODEM_RX: length 18.1
  Top Layer w0.254: R55.2 23.55,65.86 ; 23.55,65.86 23.05,66.36 Q9.2 ; 23.55,65.86 v1(25.4,64.01) ; U1.11 34.17,59.31 v1(31.62,59.31)
  Bottom Layer w0.254: v1(31.62,59.31) 29.46,59.31 27.25,61.52 27.19,61.52 26.85,61.86 26.85,61.92 25.4,63.37 v1(25.4,64.01)
MODEM_TX: length 13.8
  Top Layer w0.254: v1(31.12,60.33) 33.92,60.33 U1.10 ; v1(27.43,62.1) 24.41,62.1 ; 24.41,62.1 24.84,62.53 R52.2 ; 24.41,62.1 Q8.3
  Bottom Layer w0.254: v1(31.12,60.33) 29.21,60.33 v1(27.43,62.1)
OPTO_IN: length 5.9
  Top Layer w0.254: R65.1 50.11,51.56 48.64,51.56 47.37,52.83 47.37,54.22
RED_LED: length 52.9
  Top Layer w0.254: LED3.1 55.37,13.59 v1(53.97,14.99) ; v1(53.59,62.74) 53.21,63.12 U1.33
  Bottom Layer w0.254: v1(53.59,62.74) 53.59,15.37 v1(53.97,14.99)
RTC_SCL: length 20.5
  Top Layer w0.254: 38.48,54.35 38.48,51.05 39.75,49.78 42.29,49.78 43.69,48.39 43.69,40 43.31,39.62 U2.16
RTC_SDA: length 23.4
  Top Layer w0.254: U2.15 39.75,40.89 38.97,41.67 38.97,45.07 v1(39.12,45.21) ; v1(32.38,55.63) 32.38,57.53 32.9,58.04 U1.12
  Bottom Layer w0.254: v1(39.12,45.21) 39.12,47.69 35.49,51.32 35.49,52.14 32.38,55.25 v1(32.38,55.63)
RTS: length 14.9
  Top Layer w0.254: Q4.2 28.01,64.96 28.53,65.48 v1(28.53,67.03) 28.53,67.61 27.17,68.97 U6.24 ; 25.22,73.79 25.22,73.2 v1(25.65,72.77)
  Bottom Layer w0.254: v1(28.53,67.03) 28.53,67.61 28.07,68.07 28.07,71.05 27.42,71.7 26.73,71.7 v1(25.65,72.77)
SIM_CLK: length 11
  Top Layer w0.254: R50.1 38.35,50.29 36.32,52.32 34.54,52.32 33.52,51.3 D3.1 32.99,51.52 U7.13
SIM_DATA: length 7.5
  Top Layer w0.254: R49.1 34.72,48.64 34.42,48.64 33.78,49.28 33.78,50.55 33.53,50.8 D3.2 32.77,50.8 32.51,50.55 32.51,49.78 32.05,49.32 U7.11
SIM_RST: length 12.1
  Top Layer w0.254: D3.4 34.81,50.3 ; 34.81,50.3 35.05,50.55 35.63,50.55 37.08,49.1 R51.1 ; 34.81,50.3 34.52,50.02 v1(34.52,49.4) ; U7.12 31.37,50.55 30.73,50.55 30.48,50.8 v1(30.48,51.18)
  Bottom Layer w0.254: v1(34.52,49.4) 32.74,51.18 v1(30.48,51.18)
SIM_VDD: length 40.7
  Top Layer w0.254: U7.14 28.8,52.29 28.45,51.94 v1(27.88,51.94)
  Top Layer w0.5: CARD1.4 3.93,33.66 14.64,33.66 C14.2 C13.2 16.4,33.2 16.4,33.67 17.7,34.97 17.7,37.04 18.2,37.54 18.2,38.62 v1(18.44,38.86)
  Bottom Layer w0.5: v1(27.88,51.94) 27.76,51.82 23.11,51.82 18.41,47.12 18.41,38.89 v1(18.44,38.86)
SOLAR+: length 66.1
  Top Layer w0.7: C45.2 18.85,14.22 18.47,13.84 18.39,13.84
  Top Layer w0.8: R27.2 4.06,24.77 v1(4.13,24.83) ; 20.56,12.49 20.56,16.55 ; 20.56,12.49 20.56,2.67 CN6.1 ; 20.56,12.49 19.75,11.68 13.37,11.68 v1(13.11,11.66) 12.2,12.57 Q3.3 ; v1(23.4,22.32) 23.4,23.34 22.99,23.75 C24.2
  Bottom Layer w0.8: v1(23.4,22.32) 20.38,19.3 20.38,14.03 18.01,11.66 v1(13.11,11.66) 13.11,12.29 10.54,14.86 10.54,18.41 v1(4.13,24.83)
TRAP_TRIG: length 75.3
  Top Layer w0.254: U1.4 33.2,68.2 R5.1 32.44,66.73 32.34,66.63 v1(32.34,65.41)
  Bottom Layer w0.254: v1(32.34,65.41) 32.77,64.98 32.77,59.83 35.83,56.77 35.83,53.96 40.13,49.66 40.13,38.69 32.18,30.74 32.18,11.14 35.16,8.16 CN7.1
URX: length 32.3
  Top Layer w0.254: U1.36 50.54,66.93 v1(50.16,67.31) ; 30.48,70.36 R12.2 28.88,71.83 28.45,72.26 28.45,75.18 26.86,76.77 RXD.1
  Bottom Layer w0.254: v1(50.16,67.31) 50.16,68.83 48.64,70.36 v1(30.61,70.36)
UTX: length 34.4
  Top Layer w0.254: v1(28.88,68.2) R13.2 30.48,69.09 ; U1.37 51.67,68.2 v1(49.4,68.2) ; v1(24.45,75.5) 24.36,75.59 TXD.1
  Bottom Layer w0.254: v1(28.88,68.2) 28.57,68.5 28.57,71.37 v1(24.45,75.5) ; v1(49.4,68.2) 48.51,69.09 v1(30.61,69.09)
YELLOW_LED: length 49.2
  Top Layer w0.254: LED2.2 55.75,17.02 v1(54.74,18.03) ; U1.32 53.34,61.85 v1(54.29,60.9)
  Bottom Layer w0.254: v1(54.74,18.03) 54.29,18.48 v1(54.29,60.9)
$1N1255: length 13.6
  Top Layer w0.5: v1(39.55,42.29) 39.68,42.16 U2.14
  Bottom Layer w0.5: v1(39.55,42.29) 36.88,44.96 BT1.1
$1N2192: length 1.9
  Top Layer w0.5: 38.4,17.15 38.4,16.18 38.03,15.81 U4.6
$1N3553: length 7.6
  Top Layer w0.254: R6.1 12.32,71.73 v1(12.32,70.74) ; USBC1.B5 9.55,66.58 v1(9.91,66.93)
  Bottom Layer w0.254: v1(9.91,66.93) 12.32,69.34 v1(12.32,70.74)
$1N3558: length 4.4
  Top Layer w0.254: USBC1.A5 9.89,69.58 11.25,70.94 11.25,71.63 R7.1
$1N3569: length 6.8
  Top Layer w0.291: USBC1.A6 7.6,68.58 7.37,68.35 7.37,67.8 7.54,67.63 10.26,67.63 11.66,66.23 D1.3
$1N3598: length 6.8
  Top Layer w0.291: 9.4,68.73 9.4,68.83 9.16,69.08 USBC1.B7 ; 9.4,68.73 9.81,68.73 10.55,69.47 11.43,69.47 11.93,68.97 11.93,68.13 ; 9.4,68.73 9.4,68.33 9.15,68.08 USBC1.A7
$1N5306: length 2.6
  Top Layer w0.254: U6.11 21.29,69.39 20.8,69.39 20.64,69.22 20.64,68.74 19.85,67.94 R8.2
$1N5401: length 2.4
  Top Layer w0.254: R9.2 20.24,69.34 20.64,69.74 20.64,70.22 20.8,70.39 21.29,70.39 U6.9
$1N5544: length 4.1
  Top Layer w0.254: R10.2 R11.2 19.98,71.77 C9.2 20.19,70.61 20.57,70.99 21.35,70.99 U6.8
$1N5791: length 2
  Top Layer w0.254: U6.26 27.63,69.97 R12.1
$1N5795: length 2
  Top Layer w0.254: U6.25 27.63,69.47 R13.1
$1N6586: length 38.4
  Top Layer w0.254: v1(35.31,42.22) 36.5,43.42 36.5,46 R49.2 ; CARD1.8 3.92,37.97 v1(6.1,37.97)
  Bottom Layer w0.254: v1(35.31,42.22) 31.06,37.97 v1(6.1,37.97)
$1N6983: length 41.9
  Top Layer w0.254: v1(6.1,34.67) 3.93,34.67 CARD1.5 ; v1(33.66,39.75) 35.56,39.75 37.72,41.91 37.72,45.85 38.35,46.48 R50.2
  Bottom Layer w0.254: v1(6.1,34.67) 28.57,34.67 v1(33.66,39.75)
$1N7040: length 41.6
  Top Layer w0.254: R51.2 37.08,42.42 v1(35.81,41.15) ; v1(6.1,32.51) CARD1.3
  Bottom Layer w0.254: v1(35.81,41.15) 34.23,39.57 34.23,39.51 33.9,39.17 33.84,39.17 27.18,32.51 v1(6.1,32.51)
$1N7201: length 7.6
  Top Layer w0.348: 54.99,27.81 55.63,27.18 D5.2 ; 54.99,27.81 JP2.1 ; 54.99,27.81 51.16,27.81 U9.11
$1N7205: length 1.9
  Top Layer w0.5: R18.2 39.63,30.14 U9.6
$1N7368: length 3.5
  Top Layer w0.5: Q2.3 34.34,27.05 R17.1 34.75,27.13 35.62,28 Q1.1
$1N8617: length 13.4
  Top Layer w0.254: U7.15 27.7,53.71 v1(27.56,53.85) ; v1(18.03,53.77) 18.03,54.05 R57.2 18.55,54.55 19.85,54.55
  Bottom Layer w0.254: v1(27.56,53.85) 26.54,53.85 25.91,53.21 18.54,53.21 18.03,53.72 18.03,53.85
$1N9064: length 1.5
  Top Layer w0.254: LED1.1 58.85,20 R20.1
$1N9068: length 1.5
  Top Layer w0.254: LED2.1 58.85,16.99 R21.1
$1N9073: length 2.1
  Top Layer w0.254: R22.1 58.84,13.21 LED3.2
$1N9564: length 8.1
  Top Layer w0.348: 11.22,43.18 11.43,43.18 16.29,38.32 U7.35
$1N9643: length 3.6
  Top Layer w0.348: 7.31,43.18 JP1.1 ; 7.31,43.18 R23.1 ; 7.31,43.18 6.98,43.51 D6.2
$1N9647: length 1.4
  Top Layer w0.348: C20.2 R23.2
$1N10345: length 4.1
  Top Layer w0.4: 1.6,24.77 1.54,24.7 LED4.2 1.54,21.13 LED5.1
$1N10353: length 20.1
  Top Layer w0.4: 19.56,22.06 19.56,20.57 v1(19.18,20.19) ; v1(9.27,23.88) 6.24,20.85 LED5.2
  Bottom Layer w0.4: v1(19.18,20.19) 17.27,20.19 13.59,23.88 v1(9.27,23.88)
$1N10407: length 18.9
  Top Layer w0.4: LED4.1 6.73,22.99 9.02,25.27 17.27,25.27 18.54,24 18.54,22.08 18.56,22.06
$1N10575: length 2
  Top Layer w0.4: R28.2 17.35,23.29 17.56,23.08 17.56,22.06
$1N10583: length 1.6
  Top Layer w0.4: 16.64,22.43 16.26,22.05 C25.2
$1N10755: length 13.3
  Top Layer w1: L3.1 7.37,18.36 7.37,17.03 D4.1 D4.3 7.26,13.4 Q3.2
$1N10908: length 10.2
  Top Layer w0.5: 15.37,17.78 15.37,17.53 v1(15.68,17.21) ; v1(19.18,15.24) 19.56,15.62 U5.8 ; L3.2 14.16,18.98 15.11,18.03 R32.1
  Bottom Layer w0.5: v1(15.68,17.21) 17.65,15.24 v1(19.18,15.24)
$1N10915: length 1.6
  Top Layer w0.6: C24.1 21.56,23.74 U5.1
$1N10919: length 16.3
  Top Layer w0.5: v2(21.59,15.11) 21.59,16.52 21.56,16.55
  Bottom Layer w0.5: v2(21.59,15.11) 21.59,12.95 16.51,7.87 v1(11.05,7.87)
$1N10986: length 2.8
  Top Layer w0.5: R30.1 17.56,13.89 U5.6
$1N14725: length 1.7
  Top Layer w0.5: 27.72,66.59 26.92,65.79 R33.2
$1N14885: length 1.4
  Top Layer w0.5: 26.09,73.79 27.39,73.79 Q5.1
$1N14976: length 1.3
  Top Layer w0.5: Q5.3 29.45,72.23 R36.1
$1N14981: length 1.2
  Top Layer w0.5: Q4.3 29.45,65.37 R34.1
$1N15733: length 1.1
  Top Layer w0.254: C32.2 32.42,68.85 R40.1
$1N18802: length 25
  Top Layer w0.254: C40.2 53.47,69.81 v1(53.47,67.82) ; U1.41 v1(41.43,64.29) U1.41 ; U1.41 v1(42.83,62.89) U1.41 v1(40.03,62.89) ; U1.41 v1(42.83,65.69) U1.41 U1.41
  Bottom Layer w0.254: v1(53.47,67.82) 53.47,67.44 51.72,65.69 v1(42.83,65.69)
  vias: v1(39.84,65.69)
$1N18899: length 13
  Top Layer w0.5: STATUS.1 7.92,49.32 v1(8.89,49.32) ; v1(18.16,49.32) U7.25 15.48,49.32 R41.1
  Bottom Layer w0.5: v1(18.16,49.32) v1(8.89,49.32)
$1N19070: length 2.6
  Top Layer w0.5: Q6.1 13.27,50.64 R42.1 14.57,49.42
$1N19326: length 2.4
  Top Layer w0.5: R43.1 11.21,49.7 Q6.3
$1N19330: length 3
  Top Layer w0.5: R43.2 13.51,48.26 LED6.2
$1N19620: length 2.9
  Top Layer w0.5: R45.1 R44.2 14.75,55.27 Q7.1
$1N19629: length 2.8
  Top Layer w0.5: R46.1 12.64,54.42 11.33,55.73 Q7.3
$1N19633: length 11.2
  Top Layer w0.5: LED7.1 10.16,48.45 10.16,52.33 R46.2
$1N19644: length 12.4
  Top Layer w0.254: R44.1 16.47,55.21 v1(16.51,55.25) ; v1(23.37,54.86) 25.53,54.86 26.6,53.79 U7.16
  Bottom Layer w0.254: v1(16.51,55.25) 16.89,54.86 v1(23.37,54.86)
$1N20270: length 2.2
  Top Layer w0.3: U9.14 51.08,31.29 53.11,31.29 53.16,31.24
$1N20316: length 3.7
  Top Layer w0.254: C33.2 55.45,28.99 L4.1
  Top Layer w0.3: 54.03,31.24 54.1,31.17 L4.1
$1N31160: length 1.7
  Top Layer w1: C4.2 29.59,13.19
$1N32131: length 14.5
  Top Layer w0.254: v1(18.8,60.58) 18.41,60.96 R53.2 19.84,61.16 19.85,61.15 ; v1(24.38,53.97) 24.38,52.98 U7.18
  Bottom Layer w0.254: v1(24.38,53.97) 24.38,59.06 22.86,60.58 v1(18.8,60.58)
$1N32669: length 19.4
  Top Layer w0.254: 18.32,65.41 R54.2 16.82,64.46 v1(16.89,64.39) ; U7.17 25.5,53.75 v1(25.4,53.85)
  Bottom Layer w0.254: v1(16.89,64.39) 17.4,63.88 20.57,63.88 25.4,59.06 v1(25.4,53.85)
$1N37946: length 13.3
  Top Layer w0.5: 18.56,17.91 19.25,18.6 22.78,18.6 C26.2 23.3,18.2 24.22,18.2 24.89,17.53 C27.2 26.15,16.42 R62.2 ; 18.56,17.91 18.56,18.03 18.43,18.16 16.44,18.16 R32.2 ; 18.56,17.91 18.56,16.55
$1N37988: length 30.7
  Top Layer w0.254: PWRKEY.1 33.66,44.91 R24.2 33.57,44.92 31.84,44.92 ; U7.7 31.84,44.92 ; 31.84,44.92 31.84,45.17 33.02,46.35 v1(33.02,47.88) ; v1(27.38,56.92) 27.15,57.15 18.54,57.15 18.36,57.33 18.36,57.81 R59.2 19.84,57.86 19.85,57.85
  Bottom Layer w0.254: v1(27.38,56.92) 27.38,56.89 29.65,54.62 29.65,51.12 33.02,47.75 v1(33.02,47.88)
$1N38201: length 1.8
  Top Layer w0.254: U1.40 53.42,72.01 C41.2
$1N38264: length 5.8
  Top Layer w0.254: C42.1 30.19,74.3 32.51,74.3 33.27,73.53 33.27,72.92 U1.1
$1N38423: length 1.9
  Top Layer w0.5: U9.7 41.39,29.08 C43.2
$1N38561: length 3.7
  Top Layer w0.254: U6.3 24.25,73.94 25.36,75.06
$1N52632: length 7.7
  Top Layer w0.254: CN8.2 58.69,36.67 56.41,38.95 56.41,41.3 U10.4
$1N52637: length 10.2
  Top Layer w0.254: CN8.1 56.77,40.12 56.77,42.67 55.37,44.07 54.1,44.07 53.97,43.94 U10.3
$1N52715: length 4.6
  Top Layer w0.254: R65.2 52.38,50.17 54.48,50.17 55.25,49.4 U10.1

## Copper pours and planes (outline as drawn; the poured copper is in the pictures)
3V3 on Top Layer: 15.91,47.45 14.66,47.45 14.66,44.18 15.88,44.18 15.91,44.21
3V3 on Top Layer: 25.52,20.68 30.06,20.68 30.06,17.77 25.52,17.77
3V3 on Power Plane: 29.17,80.01 32.05,77.13 32.05,53.8 32.77,53.09 52.36,53.09 52.36,72.16 53.69,73.49 60.1,73.49 60.1,0 37.47,0 37.34,0.13 37.34,13.21 37.59,13.46 46.1,13.46 46.99,14.35 46.99,22.36 44.72,24.64 36.45,24.64 34.67,26.42 34.67,35.81 34.29,36.19 23.75,36.19 23.45,35.9 23.45,21.96 25.16,20.25 29.16,20.25 29.46,19.94 29.46,13.97 29.99,13.45 36.85,13.45 37.21,13.08 37.21,0.13 37.08,0 -0.38,0 -0.38,80.01
3V8 on Top Layer: 34.67,22.53 46.22,22.53 46.22,14.8 34.67,14.8
3V8 on Top Layer: 24.76,33.06 32.3,33.06 32.3,30.89 24.76,30.89
3V8 on Top Layer: 30.47,22.46 36.41,22.46 36.41,20.3 30.47,20.3
3V8 on Top Layer: 30.62,16.55 34.06,16.55 34.06,14.55 30.62,14.55
3V8 on Power Plane: 24.38,35.31 24.38,22.73 26.03,21.08 29.84,21.08 30.61,20.32 30.61,14.35 45.71,14.35 45.97,14.36 46.99,15.1 46.99,21.58 44.68,23.89 36.05,23.89 34.42,25.53 34.42,35.31
GND on Top Layer: 12.87,72.34 10.03,72.34 10.03,73.59 12.87,73.59
GND on Top Layer: 30.49,12.57 36.14,12.57 36.14,10.38 30.49,10.38
GND on Top Layer: 15.48,56.07 15.25,56.07 15.25,56.94 14.18,56.94 14.01,56.77 12.7,56.77 12.7,57.53 16.39,57.53 16.39,57.51 16.38,57.51 16.38,56.04 15.48,56.04
GND on Top Layer: 26.32,24.24 36.3,24.24 36.3,21.14 26.32,21.14
GND on Top Layer: 19.42,70.11 18.67,70.11 18.67,72.41 18.65,72.42 19.41,72.42 19.42,72.42
GND on Top Layer: 35.94,18.31 38.4,18.31 38.4,11.77 35.94,11.77
GND on Top Layer: 15.94,50.14 15.94,51.13 14.12,52.96 12.45,52.96 12.45,52 13.66,52 14.6,51.05 14.86,51.05 15,50.91 15,50.14
GND on Ground Ref: 0.26,79.75 60.25,79.75 60.25,0.26 0.26,0.26
+BATT on Top Layer: 25.66,15.86 28.73,15.86 28.73,12.36 25.66,12.36
$1N2196 on Top Layer: 37.21,19.43 42.42,19.43 42.42,14.48 37.21,14.48
$1N31153 on Top Layer: 30.68,18.8 35.69,18.8 35.69,15.37 30.68,15.37
$1N31160 on Top Layer: 30.63,15.14 35.59,15.14 35.59,12.43 30.63,12.43
$1N37864 on Top Layer: 29.33,9.27 30.48,9.27 30.48,7.11 29.33,7.11

Small or netless copper shapes (teardrops, artwork), in the pictures only: 53 on Ground Ref

## Text on the board
Top Silkscreen Layer: TX | SOLAR+ | REED | SDA | SCL | RX | ANA | D1 | D2 | OW | BATT+
